# EAGLE schematic bebox (EAGLE 9.2.2)
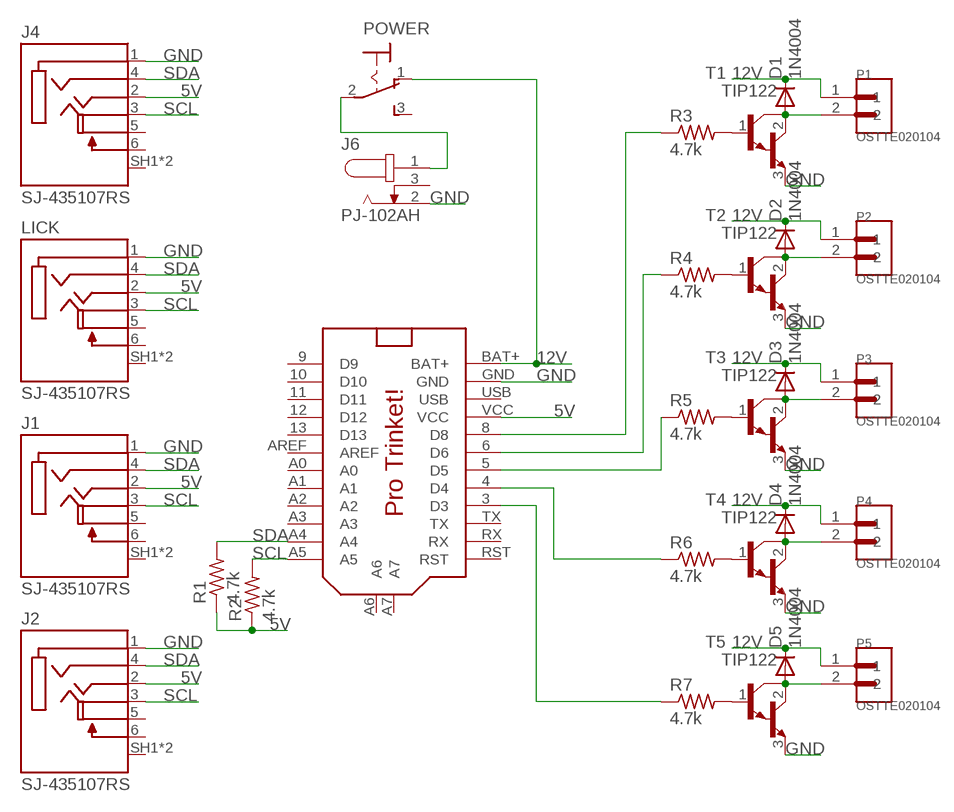
[diagram p0: schematic, sheet 1]

## Parts
D1  1N4004  [DO41-10]
D2  1N4004  [DO41-10]
D3  1N4004  [DO41-10]
D4  1N4004  [DO41-10]
D5  1N4004  [DO41-10]
J1  SJ-435107RS  [CUI_SJ-435107RS]
J2  SJ-435107RS  [CUI_SJ-435107RS]
J4  SJ-435107RS  [CUI_SJ-435107RS]
J6  PJ-102AH  [CUI_PJ-102AH]
LICK  SJ-435107RS  [CUI_SJ-435107RS]
P1  OSTTE020104  [OST_OSTTE020104]
P2  OSTTE020104  [OST_OSTTE020104]
P3  OSTTE020104  [OST_OSTTE020104]
P4  OSTTE020104  [OST_OSTTE020104]
P5  OSTTE020104  [OST_OSTTE020104]
POWER  320-916  [320-916]
R1  4.7k  R-US_0207/10  [0207/10]
R2  4.7k  R-US_0207/10  [0207/10]
R3  4.7k  R-US_0207/10  [0207/10]
R4  4.7k  R-US_0207/10  [0207/10]
R5  4.7k  R-US_0207/10  [0207/10]
R6  4.7k  R-US_0207/10  [0207/10]
R7  4.7k  R-US_0207/10  [0207/10]
T1  TIP122  [TO220]
T2  TIP122  [TO220]
T3  TIP122  [TO220]
T4  TIP122  [TO220]
T5  TIP122  [TO220]
U$1  PRO_TRINKET  [PROTRINKET]

## Nets
5V: J1.2(TIP) J2.2(TIP) J4.2(TIP) LICK.2(TIP) R1.1 R2.1 U$1.VCC
12V: D1.C D2.C D3.C D4.C D5.C P1.1 P2.1 P3.1 P4.1 P5.1 POWER.1(O) U$1.BAT+
GND: J1.1(SLEEVE) J2.1(SLEEVE) J4.1(SLEEVE) J6.2 LICK.1(SLEEVE) T1.3(E) T2.3(E) T3.3(E) T4.3(E) T5.3(E) U$1.GND
N$1: J6.1 POWER.2(P)
N$2: R3.2 T1.1(B)
N$3: D1.A P1.2 T1.2(C)
N$4: R4.2 T2.1(B)
N$5: D2.A P2.2 T2.2(C)
N$6: R5.2 T3.1(B)
N$7: D3.A P3.2 T3.2(C)
N$8: R6.2 T4.1(B)
N$9: D4.A P4.2 T4.2(C)
N$10: R7.2 T5.1(B)
N$11: D5.A P5.2 T5.2(C)
N$12: R7.1 U$1.3(D3)
N$13: R6.1 U$1.4(D4)
N$14: R5.1 U$1.5(D5)
N$15: R4.1 U$1.6(D6)
N$16: R3.1 U$1.8(D8)
SCL: J1.3(RING1) J2.3(RING1) J4.3(RING1) LICK.3(RING1) R2.2 U$1.A5
SDA: J1.4(RING2) J2.4(RING2) J4.4(RING2) LICK.4(RING2) R1.2 U$1.A4
Unconnected: J1.5(ISOLATED_RING1) J1.6(ISOLATED_RING1_SWITCH(N-O)) J1.SH1(SHIELD) J1.SH2(SHIELD) J2.5(ISOLATED_RING1) J2.6(ISOLATED_RING1_SWITCH(N-O)) J2.SH1(SHIELD) J2.SH2(SHIELD) J4.5(ISOLATED_RING1) J4.6(ISOLATED_RING1_SWITCH(N-O)) J4.SH1(SHIELD) J4.SH2(SHIELD) J6.3 LICK.5(ISOLATED_RING1) LICK.6(ISOLATED_RING1_SWITCH(N-O)) LICK.SH1(SHIELD) LICK.SH2(SHIELD) POWER.3(S) U$1.9(D9) U$1.10(D10) U$1.11(D11) U$1.12(D12) U$1.13(D13) U$1.A0 U$1.A1 U$1.A2 U$1.A3 U$1.A6 U$1.A7 U$1.AREF U$1.RST U$1.RX U$1.TX

## Power pins joined to a net without a drawn wire
USB: U$1.USB

## Library data of the parts
D1-D5 = adafruit:1N4004: DIODE General purpose 1N400x type rectifier (With bigger pads) http://www.ladyada.net/library/pcb/eaglelibrary.html
J1 J2 J4 LICK = SJ-435107RS:SJ-435107RS: 3.5 mm Right Angle Shielded (0.141", 1/8", Mini Plug) Female HeadPhone Jack; AVAILABILITY: Good; DESCRIPTION: 3.5 mm Right Angle Shielded _0.141, 1/8, Mini Plug_ Female HeadPhone Jack; MF: CUI; MP: SJ-435107RS; PACKAGE: None; PRICE: 1.04 USD
J6 = PJ-102AH:PJ-102AH: 2.0 mm Center Pin, 5.0 A, Right Angle, Through Hole, Tapered Pins, Dc Power Jack Connector; MANUFACTURER: CUI INC; PART_REV: 1.02; STANDARD: Manufacturer recommendations
P1-P5 = OSTTE020104:OSTTE020104: Terminal Block 3.5mm 2pos Pcb; DESCRIPTION: Terminal Block 3.5mm 2pos Pcb; DIGI-KEY_PART_NUMBER: ED2740-ND; DIGI-KEY_PURCHASE_URL: https://www.digikey.com/product-detail/en/on-shore-technology-inc/OSTTE020104/ED2740-ND/2351816?utm_source=snapeda&utm_medium=aggregator&utm_campaign=symbol; MF: On Shore; MP: OSTTE020104; PACKAGE: None
POWER = switch:320-916: TOGGLE SWITCH distributor RS Components
R1-R7 = rcl:R-US_: RESISTOR, American symbol; SPICEPREFIX: R
T1-T5 = transistor-neu-to92:TIP122: NPN BIPOLAR DARLINGTON TRANSISTOR
U$1 = Arthur's Library:PRO_TRINKET